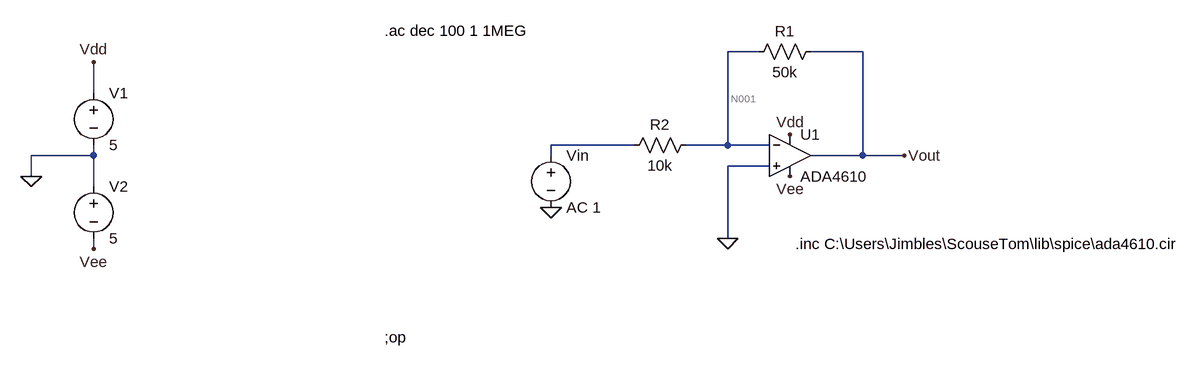
[diagram p0: schematic Import_example.asc]
Import_example.asc, the LTspice schematic file:
Version 4
SHEET 1 888 680
WIRE 208 -176 160 -176
WIRE 368 -176 288 -176
WIRE -816 -112 -816 -160
WIRE 16 -32 -112 -32
WIRE 160 -32 160 -176
WIRE 160 -32 96 -32
WIRE 224 -32 160 -32
WIRE -816 -16 -816 -32
WIRE -816 -16 -912 -16
WIRE -112 -16 -112 -32
WIRE 368 -16 368 -176
WIRE 368 -16 288 -16
WIRE 432 -16 368 -16
WIRE 224 0 160 0
WIRE -912 16 -912 -16
WIRE -816 32 -816 -16
WIRE 160 112 160 0
WIRE -816 128 -816 112
FLAG 160 112 0
FLAG -112 64 0
FLAG -912 16 0
FLAG -816 -160 Vdd
FLAG 256 -48 Vdd
FLAG -816 128 Vee
FLAG 256 16 Vee
FLAG 432 -16 Vout
SYMBOL Opamps\\opamp2 256 -80 R0
SYMATTR InstName U1
SYMATTR Value ADA4610
SYMBOL res 304 -192 R90
WINDOW 0 0 56 VBottom 2
WINDOW 3 32 56 VTop 2
SYMATTR InstName R1
SYMATTR Value 50k
SYMBOL res 112 -48 R90
WINDOW 0 0 56 VBottom 2
WINDOW 3 32 56 VTop 2
SYMATTR InstName R2
SYMATTR Value 10k
SYMBOL voltage -112 -32 R0
WINDOW 123 0 0 Left 2
WINDOW 39 0 0 Left 2
SYMATTR InstName Vin
SYMATTR Value AC 1
SYMBOL voltage -816 -128 R0
WINDOW 123 0 0 Left 2
WINDOW 39 0 0 Left 2
SYMATTR InstName V1
SYMATTR Value 5
SYMBOL voltage -816 16 R0
WINDOW 123 0 0 Left 2
WINDOW 39 0 0 Left 2
SYMATTR InstName V2
SYMATTR Value 5
TEXT -368 264 Left 2 !;op
TEXT 264 120 Left 2 !.inc C:\\Users\\Jimbles\\ScouseTom\\lib\\spice\\ada4610.cir
TEXT -368 -208 Left 2 !.ac dec 100 1 1MEG

The netlist it stands for:
* Import_example.asc
XU1 0 N001 Vdd Vee Vout ADA4610  ; pins In+ In- V+ V- OUT
R1 Vout N001 50k
R2 N001 N002 10k
Vin N002 0 AC 1
V1 Vdd 0 5
V2 0 Vee 5
;op
.inc C:\Users\Jimbles\ScouseTom\lib\spice\ada4610.cir
.ac dec 100 1 1MEG
.backanno
.end

* Results of the author's LTspice run, read from the files saved beside the schematic
* Operating Point, zero values left out:
*   V(vdd) = 5 V
*   V(vee) = -5 V
*   V(n001) = -203.1 nV
*   V(vout) = -1.369 µV
*   I(R2) = -20.31 pA
*   I(R1) = -23.31 pA
*   I(V2) = -3.301 mA
*   I(V1) = -3.301 mA
*   I(Vin) = -20.31 pA
*   Ix(u1:100) = -7 pA
*   Ix(u1:101) = -3 pA
*   Ix(u1:102) = 3.301 mA
*   Ix(u1:103) = -3.301 mA
*   Ix(u1:104) = 23.31 pA
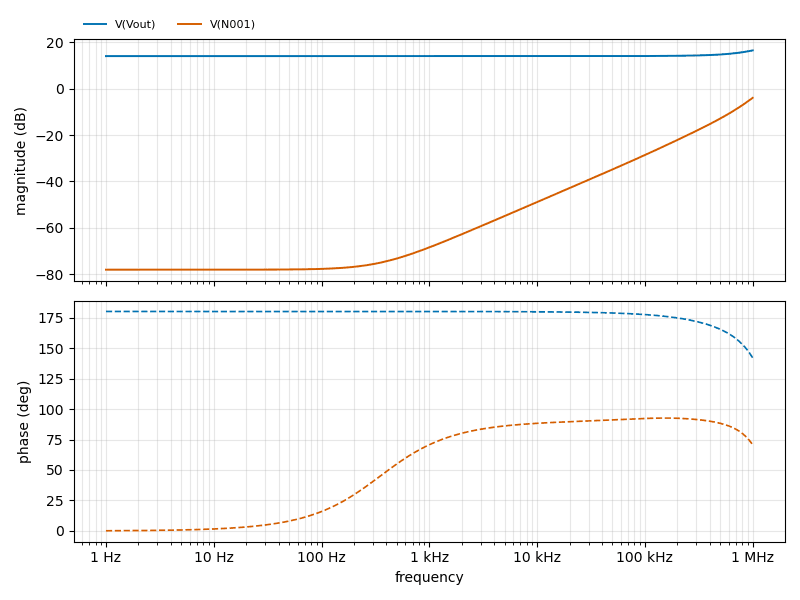
[diagram p1: AC Analysis of Import_example.asc, plotted from the saved traces]
* AC Analysis, 1 run:
*   V(Vout): 13.98 dB at 1 Hz, 16.44 dB at 1 MHz, peak 16.44 dB at 1 MHz
*   V(N001): -77.99 dB at 1 Hz, -3.99 dB at 1 MHz, peak -3.99 dB at 1 MHz, 3 dB below the peak at 811 kHz